# Altium schematic sheet Rectifire_(PFC)_Evaluation_Board.SchDoc
size A0; SheetNumber: 1; SheetTotal: 1
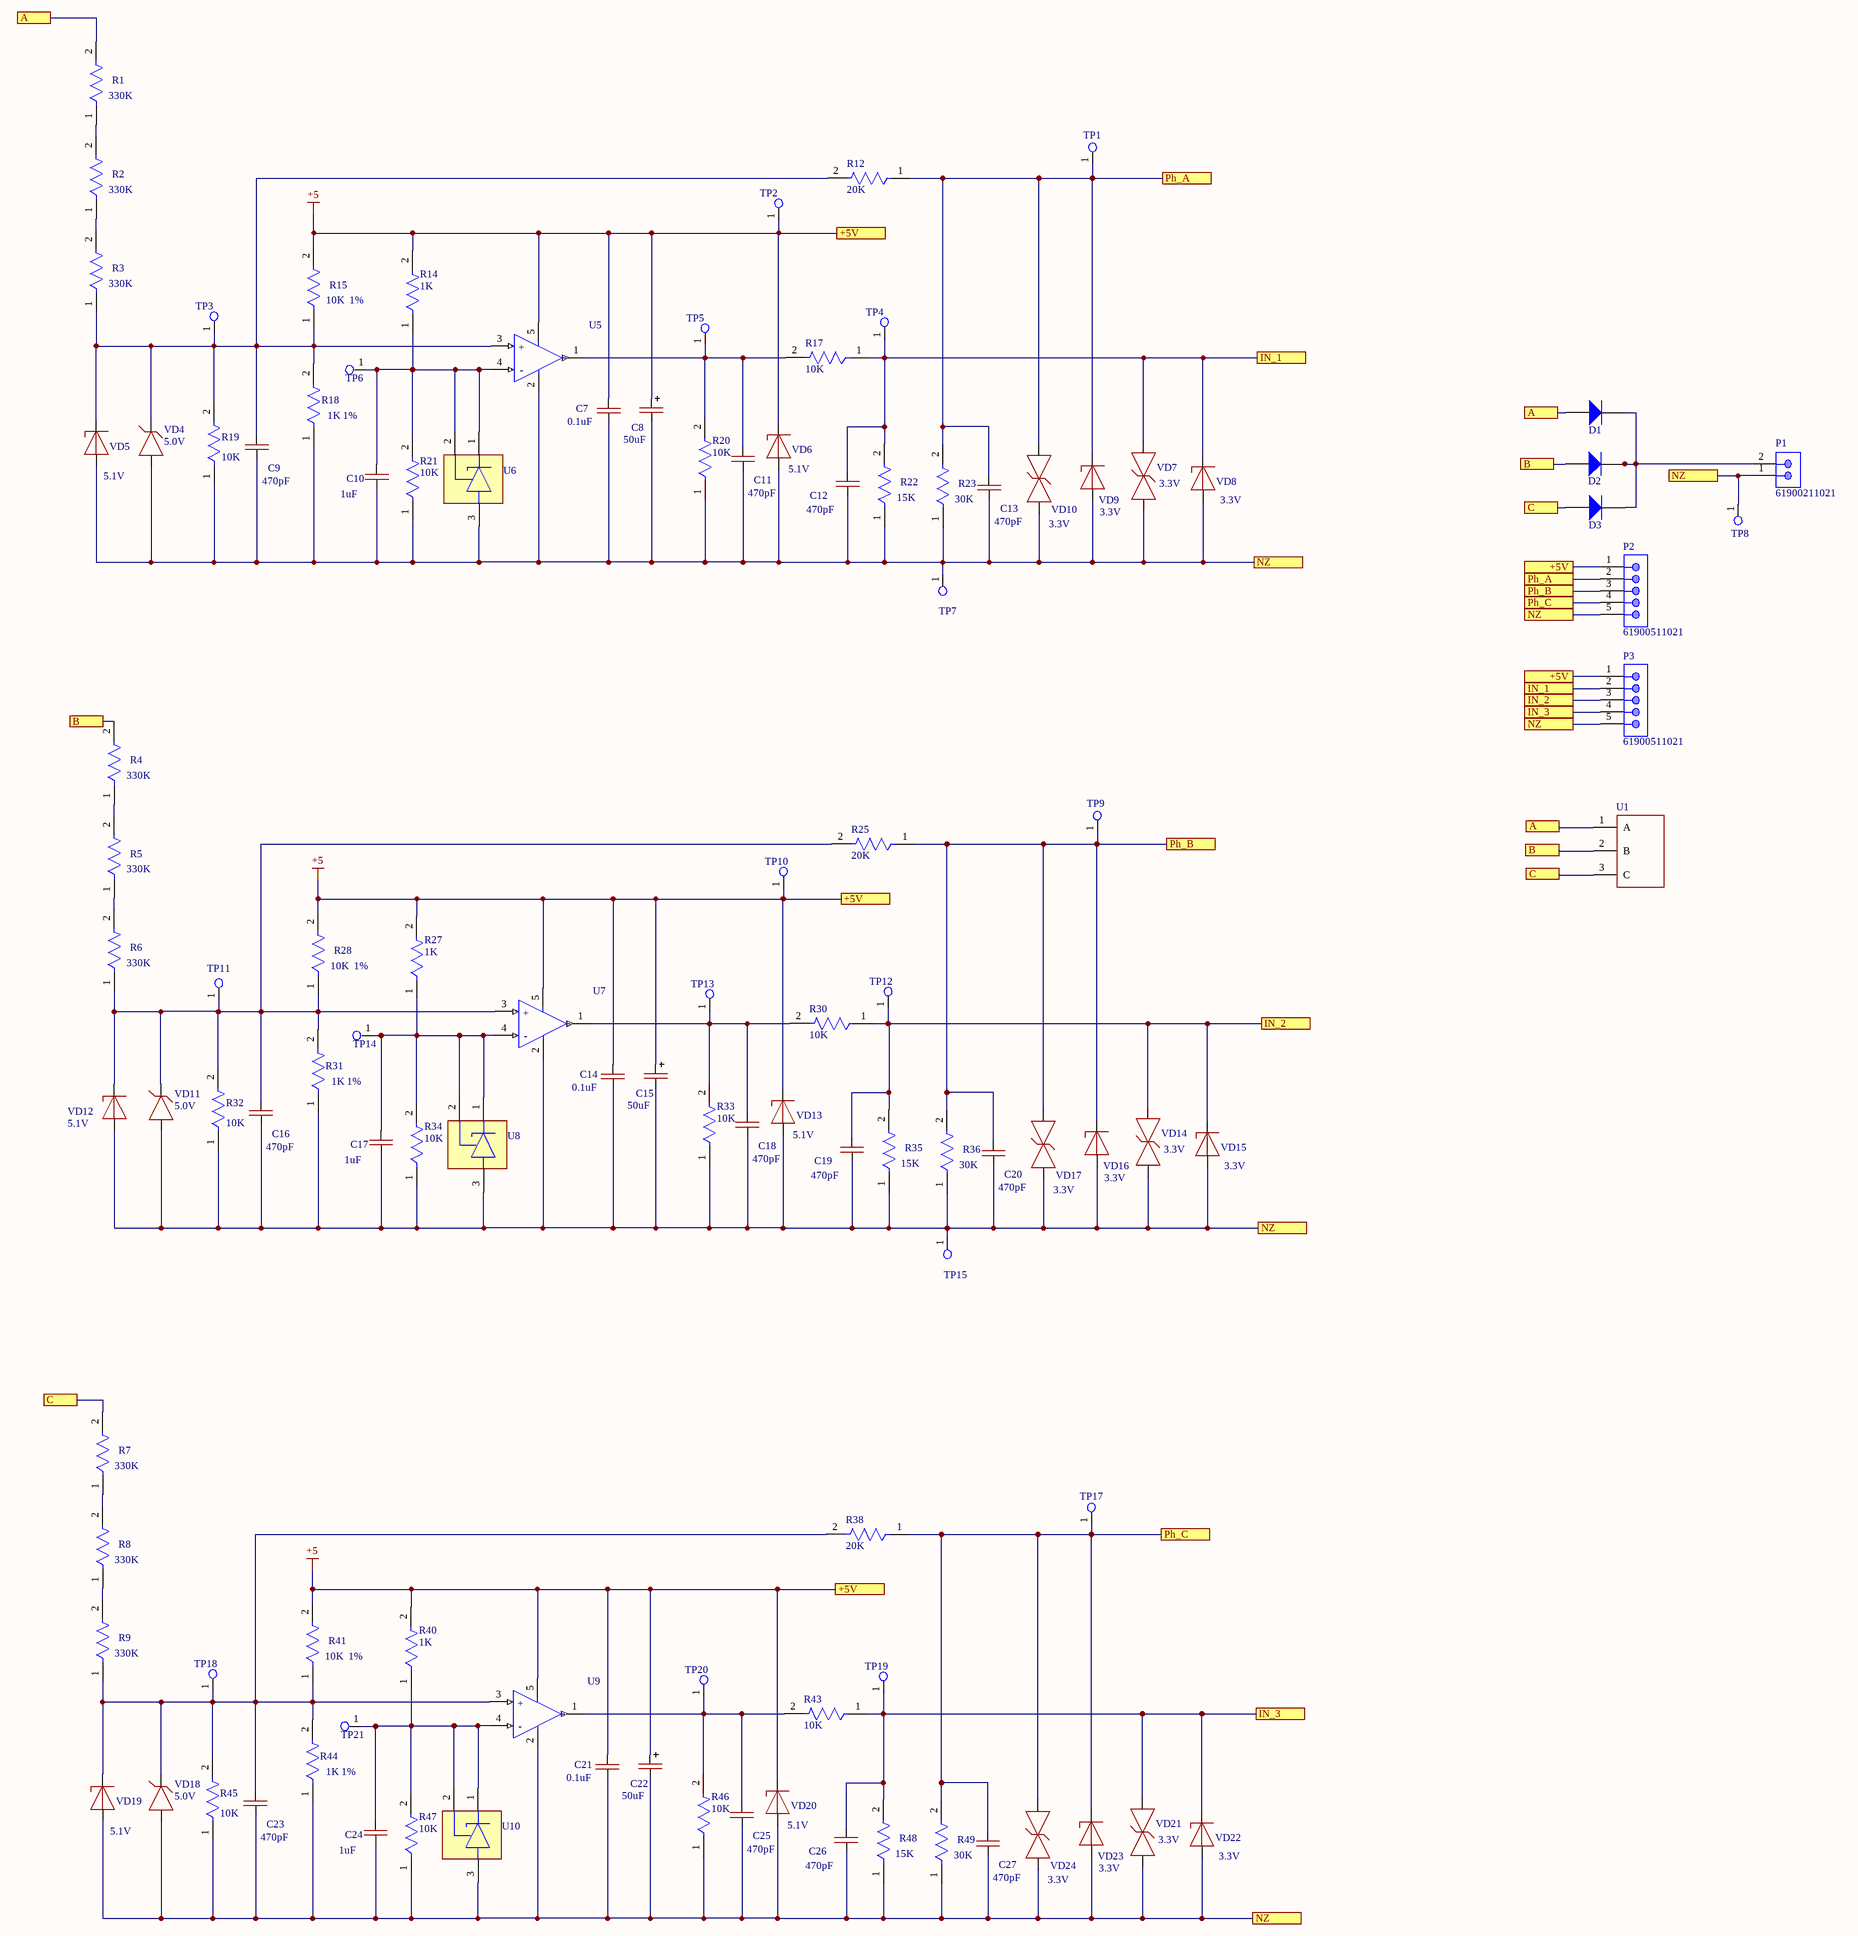
[diagram p0: Rectifire_(PFC)_Evaluation_Board.SchDoc]

## Parts
C7  0.1uF  [CAP-0805]
C8  50uF  [CAP-TAN-D]
C9  470pF  [CAP-0805]
C10  1uF  [CAP-0805]
C11  470pF  [CAP-0805]
C12  470pF  [CAP-0805]
C13  470pF  [CAP-0805]
C14  0.1uF  [CAP-0805]
C15  50uF  [CAP-TAN-D]
C16  470pF  [CAP-0805]
C17  1uF  [CAP-0805]
C18  470pF  [CAP-0805]
C19  470pF  [CAP-0805]
C20  470pF  [CAP-0805]
C21  0.1uF  [CAP-0805]
C22  50uF  [CAP-TAN-D]
C23  470pF  [CAP-0805]
C24  1uF  [CAP-0805]
C25  470pF  [CAP-0805]
C26  470pF  [CAP-0805]
C27  470pF  [CAP-0805]
D1  FR-207  [FP-DO-201AD-MFG]  (value not drawn)
D2  FR-207  [FP-DO-201AD-MFG]  (value not drawn)
D3  FR-207  [FP-DO-201AD-MFG]  (value not drawn)
P1  61900211021  [61900211021]
P2  61900511021  [61900511021]
P3  61900511021  [61900511021]
R1  330K  [RES-1206]
R2  330K  [RES-1206]
R3  330K  [RES-1206]
R4  330K  [RES-1206]
R5  330K  [RES-1206]
R6  330K  [RES-1206]
R7  330K  [RES-1206]
R8  330K  [RES-1206]
R9  330K  [RES-1206]
R12  20K  [RES-0805]
R14  1K  [RES-0805]
R15  10K  1%  [RES-0805]
R17  10K  [RES-0805]
R18  1K 1%  [RES-0805]
R19  10K  [RES_SMD_1210_IPC_B]
R20  10K  [RES-0805]
R21  10K  [RES-0805]
R22  15K  [RES-0805]
R23  30K  [RES-0805]
R25  20K  [RES-0805]
R27  1K  [RES-0805]
R28  10K  1%  [RES-0805]
R30  10K  [RES-0805]
R31  1K 1%  [RES-0805]
R32  10K  [RES_SMD_1210_IPC_B]
R33  10K  [RES-0805]
R34  10K  [RES-0805]
R35  15K  [RES-0805]
R36  30K  [RES-0805]
R38  20K  [RES-0805]
R40  1K  [RES-0805]
R41  10K  1%  [RES-0805]
R43  10K  [RES-0805]
R44  1K 1%  [RES-0805]
R45  10K  [RES_SMD_1210_IPC_B]
R46  10K  [RES-0805]
R47  10K  [RES-0805]
R48  15K  [RES-0805]
R49  30K  [RES-0805]
TP1  Test_Point_PCB  [Test_Point]  (value not drawn)
TP2  Test_Point_PCB  [Test_Point]  (value not drawn)
TP3  Test_Point_PCB  [Test_Point]  (value not drawn)
TP4  Test_Point_PCB  [Test_Point]  (value not drawn)
TP5  Test_Point_PCB  [Test_Point]  (value not drawn)
TP6  Test_Point_PCB  [Test_Point]  (value not drawn)
TP7  Test_Point_PCB  [Test_Point]  (value not drawn)
TP8  Test_Point_PCB  [Test_Point]  (value not drawn)
TP9  Test_Point_PCB  [Test_Point]  (value not drawn)
TP10  Test_Point_PCB  [Test_Point]  (value not drawn)
TP11  Test_Point_PCB  [Test_Point]  (value not drawn)
TP12  Test_Point_PCB  [Test_Point]  (value not drawn)
TP13  Test_Point_PCB  [Test_Point]  (value not drawn)
TP14  Test_Point_PCB  [Test_Point]  (value not drawn)
TP15  Test_Point_PCB  [Test_Point]  (value not drawn)
TP17  Test_Point_PCB  [Test_Point]  (value not drawn)
TP18  (no value)  [Test_Point]
TP19  (no value)  [Test_Point]
TP20  Test_Point_PCB  [Test_Point]  (value not drawn)
TP21  Test_Point_PCB  [Test_Point]  (value not drawn)
U1  (no value)  [MDS100]
U5  (no value)  [SOT-23-5]
U6  TL431  [TL431_SOT-23-3(A)]  (value not drawn)
U7  (no value)  [SOT-23-5]
U8  TL431  [TL431_SOT-23-3(A)]  (value not drawn)
U9  (no value)  [SOT-23-5]
U10  TL431  [TL431_SOT-23-3(A)]  (value not drawn)
VD4  5.0V  [SOD-323]
VD5  5.1V  [DIOD-SOD123-2_V]
VD6  5.1V  [DIOD-SOD123-2_V]
VD7  3.3V  [DO-214AA]
VD8  3.3V  [DIOD-SOD123-2_V]
VD9  3.3V  [DIOD-SOD123-2_V]
VD10  3.3V  [DO-214AA]
VD11  5.0V  [SOD-323]
VD12  5.1V  [DIOD-SOD123-2_V]
VD13  5.1V  [DIOD-SOD123-2_V]
VD14  3.3V  [DO-214AA]
VD15  3.3V  [DIOD-SOD123-2_V]
VD16  3.3V  [DIOD-SOD123-2_V]
VD17  3.3V  [DO-214AA]
VD18  5.0V  [SOD-323]
VD19  5.1V  [DIOD-SOD123-2_V]
VD20  5.1V  [DIOD-SOD123-2_V]
VD21  3.3V  [DO-214AA]
VD22  3.3V  [DIOD-SOD123-2_V]
VD23  3.3V  [DIOD-SOD123-2_V]
VD24  3.3V  [DO-214AA]

## Ports
+5V (see Rectifire_(PFC)_Evaluation_Board[4B], Rectifire_(PFC)_Evaluation_Board[4C], Rectifire_(PFC)_Evaluation_Board[7B]), +5V (see Rectifire_(PFC)_Evaluation_Board[4C], Rectifire_(PFC)_Evaluation_Board[7B]), A (see Rectifire_(PFC)_Evaluation_Board[2B], Rectifire_(PFC)_Evaluation_Board[7B]), A (see Rectifire_(PFC)_Evaluation_Board[2B], Rectifire_(PFC)_Evaluation_Board[7C]), A (see Rectifire_(PFC)_Evaluation_Board[7B], Rectifire_(PFC)_Evaluation_Board[7C]), B (see Rectifire_(PFC)_Evaluation_Board[2C], Rectifire_(PFC)_Evaluation_Board[7B]), B (see Rectifire_(PFC)_Evaluation_Board[2C], Rectifire_(PFC)_Evaluation_Board[7C]), B (see Rectifire_(PFC)_Evaluation_Board[7B], Rectifire_(PFC)_Evaluation_Board[7C]), C (see Rectifire_(PFC)_Evaluation_Board[2C], Rectifire_(PFC)_Evaluation_Board[7B]), C (see Rectifire_(PFC)_Evaluation_Board[2C], Rectifire_(PFC)_Evaluation_Board[7C]), C (see Rectifire_(PFC)_Evaluation_Board[7B], Rectifire_(PFC)_Evaluation_Board[7C]), IN_1 (see Rectifire_(PFC)_Evaluation_Board[6B]), IN_1 (see Rectifire_(PFC)_Evaluation_Board[7C]), IN_2 (see Rectifire_(PFC)_Evaluation_Board[6C]), IN_2 (see Rectifire_(PFC)_Evaluation_Board[7C]), IN_3 (see Rectifire_(PFC)_Evaluation_Board[6D]), IN_3 (see Rectifire_(PFC)_Evaluation_Board[7C]), NZ (see Rectifire_(PFC)_Evaluation_Board[6B], Rectifire_(PFC)_Evaluation_Board[6C], Rectifire_(PFC)_Evaluation_Board[6D], Rectifire_(PFC)_Evaluation_Board[7B]), NZ (see Rectifire_(PFC)_Evaluation_Board[6B], Rectifire_(PFC)_Evaluation_Board[6C], Rectifire_(PFC)_Evaluation_Board[6D], Rectifire_(PFC)_Evaluation_Board[7B], Rectifire_(PFC)_Evaluation_Board[7C]), NZ (see Rectifire_(PFC)_Evaluation_Board[6B], Rectifire_(PFC)_Evaluation_Board[6C], Rectifire_(PFC)_Evaluation_Board[7B], Rectifire_(PFC)_Evaluation_Board[7C]), NZ (see Rectifire_(PFC)_Evaluation_Board[6B], Rectifire_(PFC)_Evaluation_Board[6D], Rectifire_(PFC)_Evaluation_Board[7B], Rectifire_(PFC)_Evaluation_Board[7C]), NZ (see Rectifire_(PFC)_Evaluation_Board[6C], Rectifire_(PFC)_Evaluation_Board[6D], Rectifire_(PFC)_Evaluation_Board[7B], Rectifire_(PFC)_Evaluation_Board[7C]), Ph_A (see Rectifire_(PFC)_Evaluation_Board[5B]), Ph_A (see Rectifire_(PFC)_Evaluation_Board[7B]), Ph_B (see Rectifire_(PFC)_Evaluation_Board[5C]), Ph_B (see Rectifire_(PFC)_Evaluation_Board[7B]), Ph_C (see Rectifire_(PFC)_Evaluation_Board[5C]), Ph_C (see Rectifire_(PFC)_Evaluation_Board[7B])

## Nets
+5: C7.2 C8.1(+) C14.2 C15.1(+) C21.2 C22.1(+) P2.1 P3.1 R14.2 R15.2 R27.2 R28.2 R40.2 R41.2 TP2.1(G9) TP10.1(G9) U5.5(VDD) U7.5(VDD) U9.5(VDD) VD6.1(C) VD13.1(C) VD20.1(C) ; port +5V
A: D1.2(A) R1.2 U1.1(A) ; port A
B: D2.2(A) R4.2 U1.2(B) ; port B
C: D3.2(A) R7.2 U1.3(C) ; port C
IN_1: C12.2 P3.2 R17.1 R22.2 TP4.1(G9) VD7.2(A) VD8.1(C) ; port IN_1
IN_2: C19.2 P3.3 R30.1 R35.2 TP12.1(G9) VD14.2(A) VD15.1(C) ; port IN_2
IN_3: C26.2 P3.4 R43.1 R48.2 TP19.1(G9) VD21.2(A) VD22.1(C) ; port IN_3
NZ: C7.1 C8.2(-) C9.1 C10.1 C11.1 C12.1 C13.1 C14.1 C15.2(-) C16.1 C17.1 C18.1 C19.1 C20.1 C21.1 C22.2(-) C23.1 C24.1 C25.1 C26.1 C27.1 P1.1 P2.5 P3.5 R18.1 R19.1 R20.1 R21.1 R22.1 R23.1 R31.1 R32.1 R33.1 R34.1 R35.1 R36.1 R44.1 R45.1 R46.1 R47.1 R48.1 R49.1 TP7.1(G9) TP8.1(G9) TP15.1(G9) U5.2(VSS) U6.3(A) U7.2(VSS) U8.3(A) U9.2(VSS) U10.3(A) VD4.1(A) VD5.2(A) VD6.2(A) VD7.1(C) VD8.2(A) VD9.2(A) VD10.1(C) VD11.1(A) VD12.2(A) VD13.2(A) VD14.1(C) VD15.2(A) VD16.2(A) VD17.1(C) VD18.1(A) VD19.2(A) VD20.2(A) VD21.1(C) VD22.2(A) VD23.2(A) VD24.1(C) ; port NZ
Ph_A: C13.2 P2.2 R12.1 R23.2 TP1.1(G9) VD9.1(C) VD10.2(A) ; port Ph_A
Ph_B: C20.2 P2.3 R25.1 R36.2 TP9.1(G9) VD16.1(C) VD17.2(A) ; port Ph_B
Ph_C: C27.2 P2.4 R38.1 R49.2 TP17.1(G9) VD23.1(C) VD24.2(A) ; port Ph_C
NetC9_2: C9.2 R3.1 R12.2 R15.1 R18.2 R19.2 TP3.1(G9) U5.3(VIN+) VD4.2(C) VD5.1(C)
NetC10_2: C10.2 R14.1 R21.2 TP6.1(G9) U5.4(VIN-) U6.1(C) U6.2(REF)
NetC11_2: C11.2 R17.2 R20.2 TP5.1(G9) U5.1(VOUT)
NetC16_2: C16.2 R6.1 R25.2 R28.1 R31.2 R32.2 TP11.1(G9) U7.3(VIN+) VD11.2(C) VD12.1(C)
NetC17_2: C17.2 R27.1 R34.2 TP14.1(G9) U7.4(VIN-) U8.1(C) U8.2(REF)
NetC18_2: C18.2 R30.2 R33.2 TP13.1(G9) U7.1(VOUT)
NetC23_2: C23.2 R9.1 R38.2 R41.1 R44.2 R45.2 TP18.1(G9) U9.3(VIN+) VD18.2(C) VD19.1(C)
NetC24_2: C24.2 R40.1 R47.2 TP21.1(G9) U9.4(VIN-) U10.1(C) U10.2(REF)
NetC25_2: C25.2 R43.2 R46.2 TP20.1(G9) U9.1(VOUT)
NetD1_1: D1.1(K) D2.1(K) D3.1(K) P1.2
NetR1_1: R1.1 R2.2
NetR2_1: R2.1 R3.2
NetR4_1: R4.1 R5.2
NetR5_1: R5.1 R6.2
NetR7_1: R7.1 R8.2
NetR8_1: R8.1 R9.2

## Notes on the sheet
- (in symbol MCP6001T) +; -

## Library data of the parts
C7 C9-C14 C16-C21 C23-C27 = CAP-NON-POLAR
C8 C15 C22 = CAP-POLAR
D1-D3 = FR-207: FR207
P1 = 61900211021: WR-WTB THT Male Left Angled Bottom Locking Header, pitch 2.54mm, 2p; Pin Number: 2; Contact Resistance: 20mOhm; Rated Current: 3A; Withstanding Voltage: 1000VAC; Working Voltage: 250VAC; ComponentLink1Description: Manufacturer; ComponentLink1URL: http://www.we-online.de; ComponentLink2Description: Datasheet; ComponentLink2URL: https://www.we-online.com/catalog/datasheet/61900211021.pdf; Pitch: 2.54mm; Published Date: January 2020; Publisher: Wurth Elektronik; Mounting Technology: THT; Packaging: Bag; Operating Temperature: -40 to +105degC; Part Number: 61900211021; Gender: Male; Type: Right Angled Bottom Locking
P2 P3 = 61900511021: WR-WTB THT Male Left Angled Bottom Locking Header, pitch 2.54mm, 5p; Pin Number: 5; Contact Resistance: 20mOhm; Rated Current: 3A; Withstanding Voltage: 1000VAC; Working Voltage: 250VAC; ComponentLink1Description: Manufacturer; ComponentLink1URL: http://www.we-online.de; ComponentLink2Description: Datasheet; ComponentLink2URL: https://www.we-online.com/catalog/datasheet/61900511021.pdf; Pitch: 2.54mm; Published Date: January 2020; Publisher: Wurth Elektronik; Mounting Technology: THT; Packaging: Bag; Operating Temperature: -40 to +105degC; Part Number: 61900511021; Gender: Male; Type: Right Angled Bottom Locking
R1-R9 R15 R28 R41 = RES-CONST: 10K
R12 R17 R20-R23 R25 R30 R33-R36 R38 R43 R46-R49 = RES-CONST
R14 R27 R40 = RES-CONST: 4.7K
R18 R31 R44 = RES-CONST: 1K
R19 R32 R45 = RES_1210
TP1-TP15 TP17-TP21 = TP_PCB?: Test_Point
U1 = MDS100: Gain Bandwidth Product: 1MHz; Number of Circuits: 2; Min Supply Voltage: 3V; Slew Rate: 0.6V/µs; Max Dual Supply Voltage: 16V; Common Mode Rejection Ratio: 65dB; Input Bias Current: 250nA; Min Dual Supply Voltage: 1.5V; Dual Supply Voltage: 9V; Operating Supply Current: 1.5mA; Output Current: 40mA; Input Offset Voltage (Vos): 7mV; Nominal Supply Current: 1.2mA; Voltage Gain: 100dB; Max Supply Voltage: 32V; Width: 4mm; Number of Pins: 8; Min Operating Temperature: 0°C; REACH SVHC: No SVHC; Contact Plating: Tin; Lead Free: Lead Free; Halogen Free: Halogen Free; Power Supply Rejection Ratio (PSRR): 65dB; Operating Supply Voltage: 16V; Package Quantity: 2500; Max Operating Temperature: 70°C; Case/Package: SOIC; Height: 1.5mm; Packaging: Tape and Reel; Radiation Hardening: No; Number of Channels: 2; Bandwidth: 1MHz; Length: 5mm; Number of Elements: 2; Number of Amplifiers: 2; Output Current per Channel: 40mA
U5 U7 U9 = MCP6001T: IC OPAMP GP 1 CIRCUIT SOT23-5; Number of Amplifiers: 1; Voltage: 6V; Power Supply Rejection Ratio (PSRR): 86dB; Common Mode Rejection Ratio: 60dB; Unity Gain Bandwidth Product: 1MHz; Slew Rate: 0.6V/µs; Output Current per Channel: 23mA; Nominal Supply Current: 100uA; Input Offset Voltage (Vos): 4.5mV; Input Bias Current: 1pA; Operating Supply Voltage: 5.5V; Min Supply Voltage: 1.8V; Voltage Gain: 112dB; Length: 3.1mm; REACH SVHC: No SVHC; Number of Pins: 5; Package Quantity: 1; Radiation Hardening: No; Mount: Surface Mount; Number of Circuits: 1; Number of Elements: 1; Output Current: 23mA; Packaging: Tape and Reel; Height: 1.3mm; Lead Free: Lead Free; Min Operating Temperature: -40°C; Bandwidth: 1MHz; Contact Plating: Tin; Max Supply Voltage: 6V; Max Operating Temperature: 85°C; Width: 1.8mm; Case/Package: SOT-23; Operating Supply Current: 100uA; Number of Channels: 1; Gain Bandwidth Product: 1MHz
U6 U8 U10 = TL431_SOT-23-3
VD4 VD11 VD18 = SMBJ15A
VD5 VD6 VD8 VD9 VD12 VD13 VD15 VD16 VD19 VD20 VD22 VD23 = ZENER
VD7 VD10 VD14 VD17 VD21 VD24 = Suppressor